# EAGLE schematic Gadget-Box-PiZero (EAGLE 6.6.0)
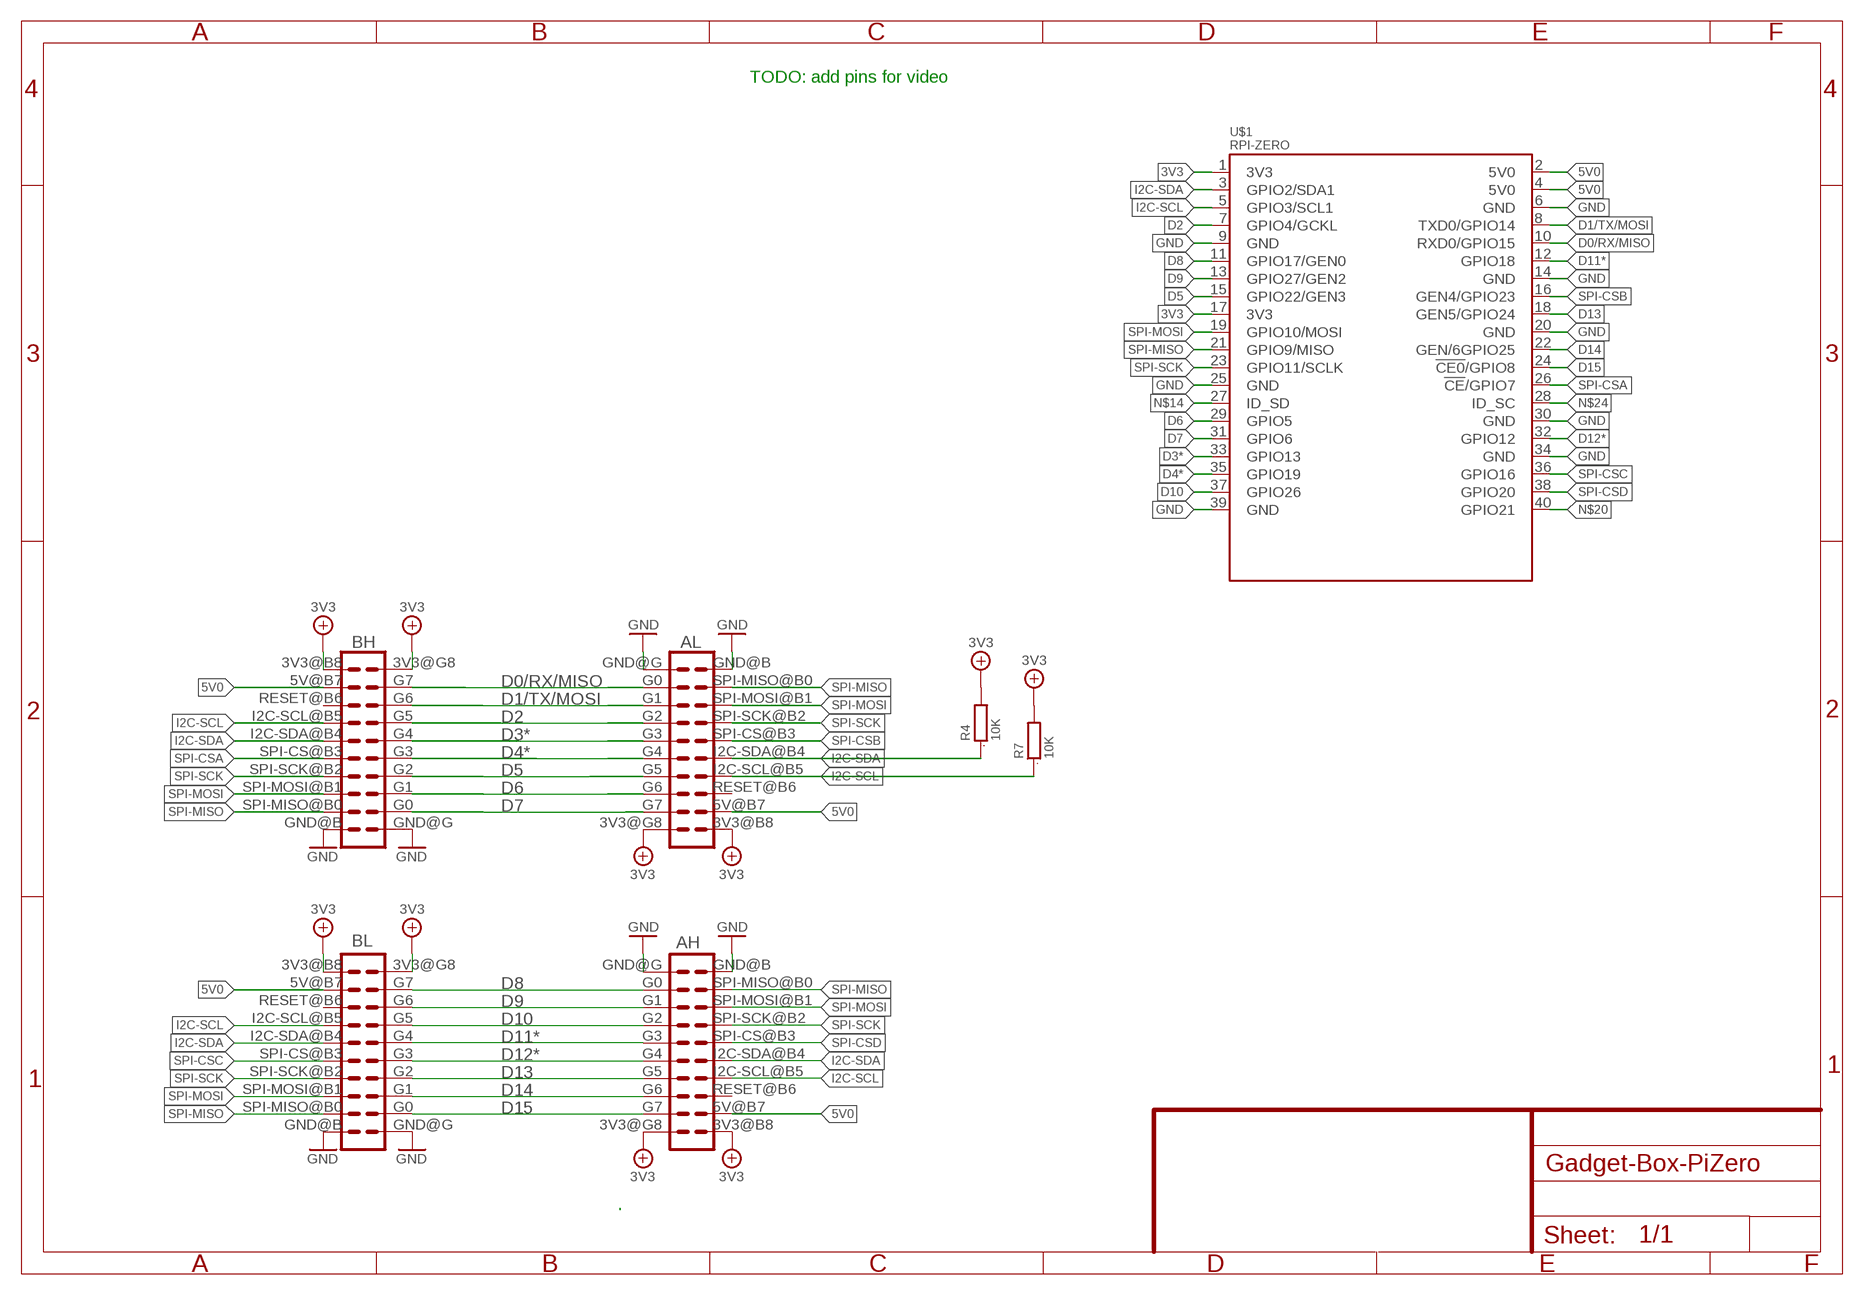
[diagram p0: schematic, sheet 1]

## Parts
AH  ECOGECOG_SLOT_ALT1  [ECOG_ALT1]
AL  ECOGECOG_SLOT_ALT1  [ECOG_ALT1]
BH  ECOGECOG_SLOT_ALT1  [ECOG_ALT1]
BL  ECOGECOG_SLOT_ALT1  [ECOG_ALT1]
R4  10K  R0603  [0603]
R7  10K  R0603  [0603]
U$1  RPI-ZERO  [RASPBERRYPI_BASTELSTUBE_V13_RASPI_BOARD_B+_FULL]

## Nets
3V3: AH.3V3@B8(3V3) AH.3V3@G8(3V3) AL.3V3@B8(3V3) AL.3V3@G8(3V3) BH.3V3@B8(3V3) BH.3V3@G8(3V3) BL.3V3@B8(3V3) BL.3V3@G8(3V3) R4.2 R7.2 U$1.1(3V3) U$1.17(3V3)
5V0: AH.5V@B7(5V) AL.5V@B7(5V) BH.5V@B7(5V) BL.5V@B7(5V) U$1.2(5V0) U$1.4(5V0)
D0/RX/MISO: AL.G0 BH.G7 U$1.10(RXD0/GPIO15)
D1/TX/MOSI: AL.G1 BH.G6 U$1.8(TXD0/GPIO14)
D2: AL.G2 BH.G5 U$1.7(GPIO4/GCKL)
D3*: AL.G3 BH.G4 U$1.33(GPIO13)
D4*: AL.G4 BH.G3 U$1.35(GPIO19)
D5: AL.G5 BH.G2 U$1.15(GPIO22/GEN3)
D6: AL.G6 BH.G1 U$1.29(GPIO5)
D7: AL.G7 BH.G0 U$1.31(GPIO6)
D8: AH.G0 BL.G7 U$1.11(GPIO17/GEN0)
D9: AH.G1 BL.G6 U$1.13(GPIO27/GEN2)
D10: AH.G2 BL.G5 U$1.37(GPIO26)
D11*: AH.G3 BL.G4 U$1.12(GPIO18)
D12*: AH.G4 BL.G3 U$1.32(GPIO12)
D13: AH.G5 BL.G2 U$1.18(GEN5/GPIO24)
D14: AH.G6 BL.G1 U$1.22(GEN/6GPIO25)
D15: AH.G7 BL.G0 U$1.24(!CE0!/GPIO8)
GND [gnd]: AH.GND@B(GND) AH.GND@G(GND) AL.GND@B(GND) AL.GND@G(GND) BH.GND@B(GND) BH.GND@G(GND) BL.GND@B(GND) BL.GND@G(GND) U$1.6(GND) U$1.9(GND) U$1.14(GND) U$1.20(GND) U$1.25(GND) U$1.30(GND) U$1.34(GND) U$1.39(GND)
I2C-SCL: AH.I2C-SCL@B5(I2C-SCL) AL.I2C-SCL@B5(I2C-SCL) BH.I2C-SCL@B5(I2C-SCL) BL.I2C-SCL@B5(I2C-SCL) R7.1 U$1.5(GPIO3/SCL1)
I2C-SDA: AH.I2C-SDA@B4(I2C-SDA) AL.I2C-SDA@B4(I2C-SDA) BH.I2C-SDA@B4(I2C-SDA) BL.I2C-SDA@B4(I2C-SDA) R4.1 U$1.3(GPIO2/SDA1)
N$14: U$1.27(ID_SD)
N$20: U$1.40(GPIO21)
N$24: U$1.28(ID_SC)
SPI-CSA: BH.SPI-CS@B3(SPI-CS) U$1.26(!CE!/GPIO7)
SPI-CSB: AL.SPI-CS@B3(SPI-CS) U$1.16(GEN4/GPIO23)
SPI-CSC: BL.SPI-CS@B3(SPI-CS) U$1.36(GPIO16)
SPI-CSD: AH.SPI-CS@B3(SPI-CS) U$1.38(GPIO20)
SPI-MISO: AH.SPI-MISO@B0(SPI-MISO) AL.SPI-MISO@B0(SPI-MISO) BH.SPI-MISO@B0(SPI-MISO) BL.SPI-MISO@B0(SPI-MISO) U$1.21(GPIO9/MISO)
SPI-MOSI: AH.SPI-MOSI@B1(SPI-MOSI) AL.SPI-MOSI@B1(SPI-MOSI) BH.SPI-MOSI@B1(SPI-MOSI) BL.SPI-MOSI@B1(SPI-MOSI) U$1.19(GPIO10/MOSI)
SPI-SCK: AH.SPI-SCK@B2(SPI-SCK) AL.SPI-SCK@B2(SPI-SCK) BH.SPI-SCK@B2(SPI-SCK) BL.SPI-SCK@B2(SPI-SCK) U$1.23(GPIO11/SCLK)
Unconnected: AH.RESET@B6(RESET) AL.RESET@B6(RESET) BH.RESET@B6(RESET) BL.RESET@B6(RESET)

## Notes on the sheet
- TODO: add pins for video

## Library data of the parts
AH AL BH BL = eCogs:ECOG; PARTNO: PPPC102LFBN-RC,SULLINS CONNECTOR SOLUTIONS,dk,S6106-ND,"CONN HEADER FEM 20POS.1"" DL GOLD", REF67
R4 R7 = GadgetFactory:R: RESISTOR, European symbol; PARTNO: RC0603JR-0710KL,YAGEO (VA),dk,311-10KGRCT-ND,RES SMD 10K OHM 5% 1/10W 0603 , REF36
U$1 = RPI-Zero:RPI-ZERO; BOM: EXCLUDE

## Net classes
2 gnd: width 0.254 mm, drill 0.381 mm, clearance 0.254 mm
3 usbvcc: width 0.254 mm, drill 0.381 mm, clearance 0.254 mm
4 aref: width 0.254 mm, drill 0.381 mm, clearance 0.254 mm